# EAGLE design Qwiic GPS - Ublox SAM-M8Q (EAGLE 9.3.0)
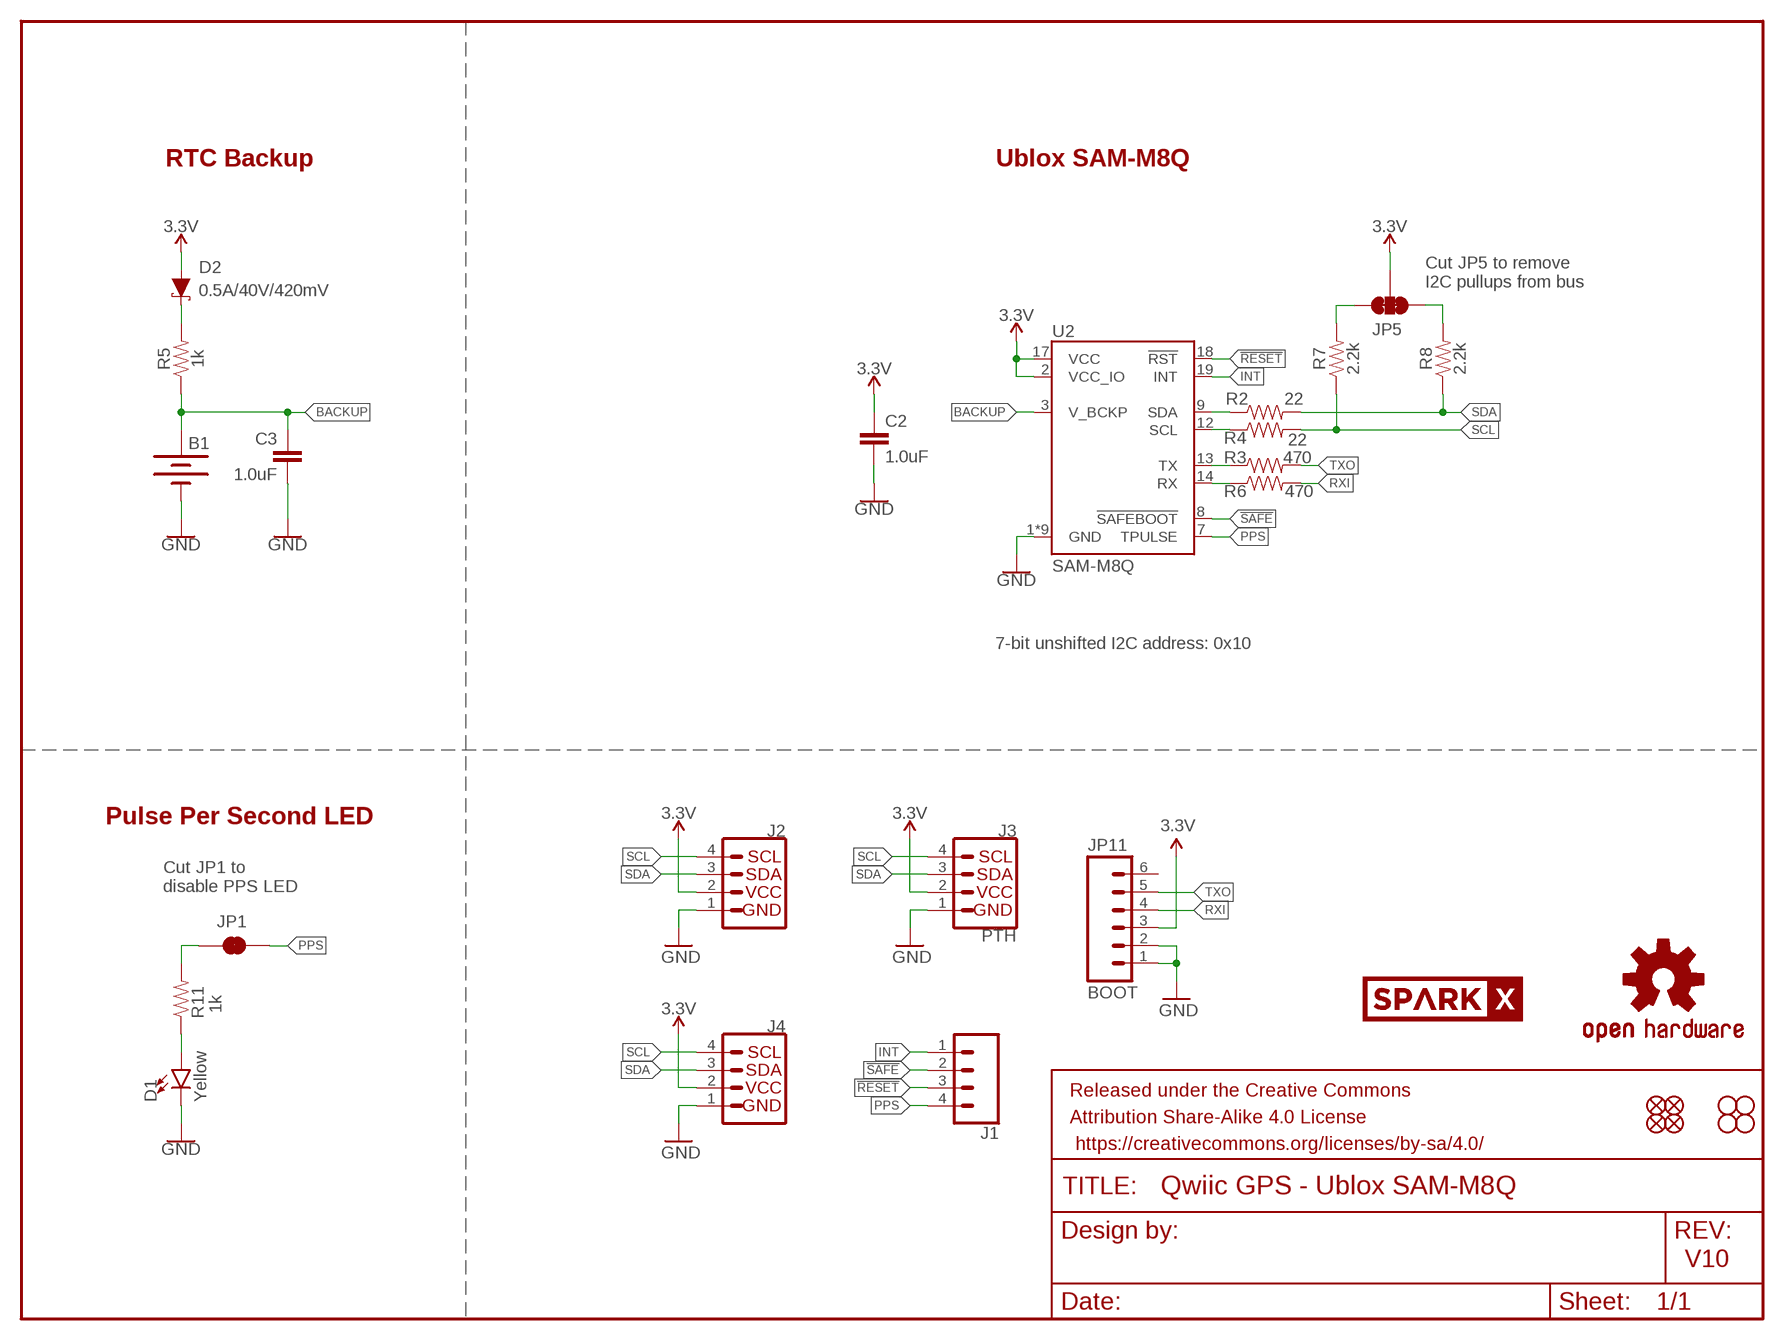
[diagram p0: schematic, sheet 1]

## Parts
B1  6.8MM_COIN_CELL  ML414H_IV01E_BATTERY  [ML414H_IV01E]
C2  1.0uF  1.0UF-0603-16V-10%  [0603]
C3  1.0uF  1.0UF-0603-16V-10%  [0603]
D1  Yellow  LED-YELLOW0603  [LED-0603]
D2  0.5A/40V/420mV  DIODE-SCHOTTKY-PMEG4005EJ  [SOD-323]
FRAME1  FRAME-LETTER  [CREATIVE_COMMONS]
J1  CONN_041X04_NO_SILK  [1X04_NO_SILK]
J2  I2C_STANDARDQWIIC  [1X04_1MM_RA]
J3  PTH  I2C_STANDARD_NO_SILK  [1X04_NO_SILK]
J4  I2C_STANDARDQWIIC  [1X04_1MM_RA]
JP1  JUMPER-SMT_2_NC_TRACE_SILK  [SMT-JUMPER_2_NC_TRACE_SILK]
JP2  FIDUCIALUFIDUCIAL  [MICRO-FIDUCIAL]
JP3  STAND-OFF  [STAND-OFF]
JP4  STAND-OFF  [STAND-OFF]
JP5  JUMPER-SMT_3_2-NC_TRACE_SILK  [SMT-JUMPER_3_2-NC_TRACE_SILK]
JP6  FIDUCIALUFIDUCIAL  [MICRO-FIDUCIAL]
JP7  FIDUCIALUFIDUCIAL  [MICRO-FIDUCIAL]
JP8  FIDUCIALUFIDUCIAL  [MICRO-FIDUCIAL]
JP9  STAND-OFF  [STAND-OFF]
JP10  STAND-OFF  [STAND-OFF]
JP11  BOOT  M06NO_SILK_FEMALE_PTH  [1X06_NO_SILK]
LOGO1  OSHW-LOGOMINI  [OSHW-LOGO-MINI]
R2  22  22OHM-0603-1/10W-1%  [0603]
R3  470  470OHM-0603-1/10W-1%  [0603]
R4  22  22OHM-0603-1/10W-1%  [0603]
R5  1k  1KOHM-0603-1/10W-1%  [0603]
R6  470  470OHM-0603-1/10W-1%  [0603]
R7  2.2k  2.2KOHM-0603-1/10W-1%  [0603]
R8  2.2k  2.2KOHM-0603-1/10W-1%  [0603]
R11  1k  1KOHM-0603-1/10W-1%  [0603]
U2  SAM-M8Q  [SAM-M8Q]
U$31  SPARKX-LOGO4  [SPARKX-MEDIUM]

## Nets
3.3V: C2.1 D2.A J2.2 J3.2(VCC) J4.2 JP5.2 JP11.3 U2.2(VCC_IO) U2.17(VCC)
!RESET: J1.3 U2.18(!RST)
!SAFE: J1.2 U2.8(!SAFEBOOT)
BACKUP: B1.+ C3.1 R5.1 U2.3(V_BCKP)
GND: B1.- C2.2 C3.2 D1.C J2.1 J3.1(GND) J4.1 JP11.1 JP11.2 U2.1(GND) U2.4(GND) U2.5(GND) U2.6(GND) U2.10(GND) U2.11(GND) U2.15(GND) U2.16(GND) U2.20(GND)
INT: J1.1 U2.19(INT)
N$2: D1.A R11.1
N$4: JP1.1 R11.2
N$5: JP5.1 R8.2
N$6: D2.C R5.2
N$8: JP5.3 R7.2
PPS: J1.4 JP1.2 U2.7(TPULSE)
RXI: JP11.4 R6.2
RXLV: R6.1 U2.14(RX)
SCL: J2.4 J3.4(SCL) J4.4 R4.2 R7.1
SCL_LV: R4.1 U2.12(SCL)
SDA: J2.3 J3.3(SDA) J4.3 R2.2 R8.1
SDA_LV: R2.1 U2.9(SDA)
TXLV: R3.1 U2.13(TX)
TXO: JP11.5 R3.2
Unconnected: JP11.6

## Notes on the sheet
- RTC Backup | Ublox SAM-M8Q
- Cut JP5 to remove 
  I2C pullups from bus
- 7-bit unshifted I2C address: 0x10
- Pulse Per Second LED
- Cut JP1 to 
  disable PPS LED
- V10

## Library data of the parts
B1 = SparkFun-Batteries:ML414H_IV01E_BATTERY: SEIKO ML414H-IV01E Reflowable Lithium Battery ML414H is a rechargeable, coin type battery with features such as Pb-free reflowable (Peak temperature: 260 C) and high temperature heat resistance. Battery Characteristics: 3.1V max voltage Voff is 2V 1mAH 3k series resistor with battery 72 hour charge time from 2.0-3.1V 2.3-2.8V initial charge; PROD_ID: BATT-14267
C2 C3 = SparkFun-Capacitors:1.0UF: 1µF ceramic capacitors A capacitor is a passive two-terminal electrical component used to store electrical energy temporarily in an electric field.; PROD_ID: CAP-00868
D1 = SparkFun-LED:LED-YELLOW: Yellow SMD LED Used in manufacturing several products at SparkFun. Packages: 0603 - SMD 0603 package[Product Link] <http://www.kingbrightusa.com/product.asp?catalog_name=LED&product_id=APT1608SYCK> 0603 -SMART - SMART SMD 0603 package (more efficient/more expensive) [Product Link] <http://www.osram-os.com/osram_os/en/products/product-catalog/led-light-emitting-diodes/smartled-0603/ly-l29k/index.jsp> LilyPad - SMD1206 package[Product Datasheet] <https://www.sparkfun.com/datasheets/DevTools/LilyPad/Q150YUS4.pdf> SparkFun Products: Blynk Board <https://www.sparkfun.com/products/13794> IOIO-OTG <https://www.sparkfun.com/products/13613> XBee Explorer Serial <https://www.sparkfun.com/products/13225>; PROD_ID: DIO-09003
D2 = SparkFun-DiscreteSemi:DIODE-SCHOTTKY: Schottky diode A Schottky diode is a semiconductor diode which has a low forward voltage drop and a very fast switching action.; PROD_ID: DIO-10955
FRAME1 = SparkFun-Aesthetics:FRAME-LETTER: Schematic Frame - Letter Standard 8.5x11 US Letter frame
J1 = SparkFun-Connectors:CONN_04: Multi connection point. Often used as Generic Header-pin footprint for 0.1 inch spaced/style header connections On any of the 0.1 inch spaced packages, you can populate with these: Break Away Headers - Straight <https://www.sparkfun.com/products/116> (PRT-00116) Break Away Male Headers - Right Angle <https://www.sparkfun.com/products/553> (PRT-00553) Female Headers <https://www.sparkfun.com/products/115> (PRT-00115) Break Away Headers - Machine Pin <https://www.sparkfun.com/products/117> (PRT-00117) Break Away Female Headers - Swiss Machine Pin <https://www.sparkfun.com/products/743> (PRT-00743) For SCREWTERMINALS and SPRING TERMINALS visit here: Screw Terimnals on SparkFun.com <https://www.sparkfun.com/search/results?term=Screw+Terminals> (5mm/3.5mm/2.54mm spacing) This device is also useful as a general connection point to wire up your design to another part of your project. Our various solder wires solder well into these plated through hole pads. Hook-Up Wire - Assortment (Stranded, 22 AWG) <https://www.sparkfun.com/products/11375> (PRT-11375) Hook-Up Wire - Assortment (Solid Core, 22 AWG) <https://www.sparkfun.com/products/11367> (PRT-11367) View the entire wire category on our website here <https://www.sparkfun.com/categories/141> Special notes: Molex polarized connector foot print use with SKU : PRT-08231 with associated crimp pins and housings. 1MM SMD Version SKU: PRT-10208; PROD_ID: CONN-09696
J2 J4 = SparkFun-Connectors:I2C_STANDARD: SparkFun I2C Standard Pinout Header SparkFun has standardized on a pinout for all I2C based sensor breakouts. This pinout allows I2C boards to be plugged directly into the headers on Arduino Uno compatible boards, and to be daisy chained easily. Example SparkFun Products: SparkFun Atmospheric Sensor Breakout - BME280 <https://www.sparkfun.com/products/13676> SparkFun Altitude/Pressure Sensor Breakout - MPL3115A2 <https://www.sparkfun.com/products/11084> SparkFun TOF Range Finder Sensor - VL6180 <https://www.sparkfun.com/products/12785>; PROD_ID: CONN-13694; VALUE: Qwiic Right Angle
J3 = SparkX:I2C_STANDARD: SparkFun I2C Standard Pinout Header SparkFun has standardized on a pinout for all I2C based sensor breakouts. This pinout allows I2C boards to be plugged directly into the headers on Arduino Uno compatible boards, and to be daisy chained easily. Example SparkFun Products: SparkFun Atmospheric Sensor Breakout - BME280 <https://www.sparkfun.com/products/13676> SparkFun Altitude/Pressure Sensor Breakout - MPL3115A2 <https://www.sparkfun.com/products/11084> SparkFun TOF Range Finder Sensor - VL6180 <https://www.sparkfun.com/products/12785>
JP1 = SparkFun-Jumpers:JUMPER-SMT_2_NC_TRACE: Normally closed trace jumper This jumper has a trace between two pads so it's normally closed (NC). Use a razor knife to open the connection. For best results follow the IPC guidelines for cutting traces: Cutout at least 0.063 mm (0.005 in). Remove all loose material to clean up the cut area. Seal the cut with an approved epoxy. Reapply solder to reclose the connection.
JP2 JP6-JP8 = SparkFun:FIDUCIAL: Fiducial Alignment Points Various fiducial points for machine vision alignment.
JP3 JP4 JP9 JP10 = SparkFun:STAND-OFF: Stand Off This is the mechanical footprint for a #4 phillips button head screw. Use the keepout ring to avoid running the screw head into surrounding components. SKU : PRT-00447
JP5 = SparkFun-Jumpers:JUMPER-SMT_3_2-NC_TRACE: Normally closed trace jumper (2 of 2 connections) This jumper has a trace between all three pads so they are normally closed (NC). Use a razor knife to open the connection(s). For best results follow the IPC guidelines for cutting traces: Cutout at least 0.063 mm (0.005 in). Remove all loose material to clean up the cut area. Seal the cut with an approved epoxy. Reapply solder to reclose the connection(s).
JP11 = SparkFun-Connectors:M06: Header 6 Standard 6-pin 0.1" header. Use with straight break away headers (SKU : PRT-00116), right angle break away headers (PRT-00553), swiss pins (PRT-00743), machine pins (PRT-00117), and female headers (PRT-00115). Molex polarized connector foot print use with SKU : PRT-08094 with associated crimp pins and housings. NOTES ON THE VARIANTS LOCK and LOCK_LONGPADS... This footprint was designed to help hold the alignment of a through-hole component (i.e. 6-pin header) while soldering it into place. You may notice that each hole has been shifted either up or down by 0.005 of an inch from it's more standard position (which is a perfectly straight line). This slight alteration caused the pins (the squares in the middle) to touch the edges of the holes. Because they are alternating, it causes a "brace" to hold the component in place. 0.005 has proven to be the perfect amount of "off-center" position when using our standard breakaway headers. Although looks a little odd when you look at the bare footprint, once you have a header in there, the alteration is very hard to notice. Also,if you push a header all the way into place, it is covered up entirely on the bottom side. This idea of altering the position of holes to aid alignment will be further integrated into the Sparkfun Library for other footprints. It can help hold any component with 3 or more connection pins.; PROD_ID: CONN-08437
LOGO1 = SparkFun-Aesthetics:OSHW-LOGO: Open-Source Hardware (OSHW) Logo This logo indicates the piece of hardware it is found on incorporates a OSHW license and/or adheres to the definition of open source hardware found here: http://freedomdefined.org/OSHW
R2 R4 = SparkFun-Resistors:22OHM: 22Ω resistor A resistor is a passive two-terminal electrical component that implements electrical resistance as a circuit element. Resistors act to reduce current flow, and, at the same time, act to lower voltage levels within circuits. - Wikipedia; PROD_ID: RES-08698
R3 R6 = SparkFun-Resistors:470OHM: 470Ω resistor A resistor is a passive two-terminal electrical component that implements electrical resistance as a circuit element. Resistors act to reduce current flow, and, at the same time, act to lower voltage levels within circuits. - Wikipedia; PROD_ID: RES-07869
R5 R11 = SparkFun-Resistors:1KOHM: 1kΩ resistor A resistor is a passive two-terminal electrical component that implements electrical resistance as a circuit element. Resistors act to reduce current flow, and, at the same time, act to lower voltage levels within circuits. - Wikipedia; PROD_ID: RES-07856
R7 R8 = SparkFun-Resistors:2.2KOHM: 2.2kΩ resistor A resistor is a passive two-terminal electrical component that implements electrical resistance as a circuit element. Resistors act to reduce current flow, and, at the same time, act to lower voltage levels within circuits. - Wikipedia; PROD_ID: RES-08272
U2 = SAM-M8Q:SAM-M8Q
U$31 = SparkX:SPARKX-LOGO

## Net classes
1 vcc: width 0.152 mm

## Board
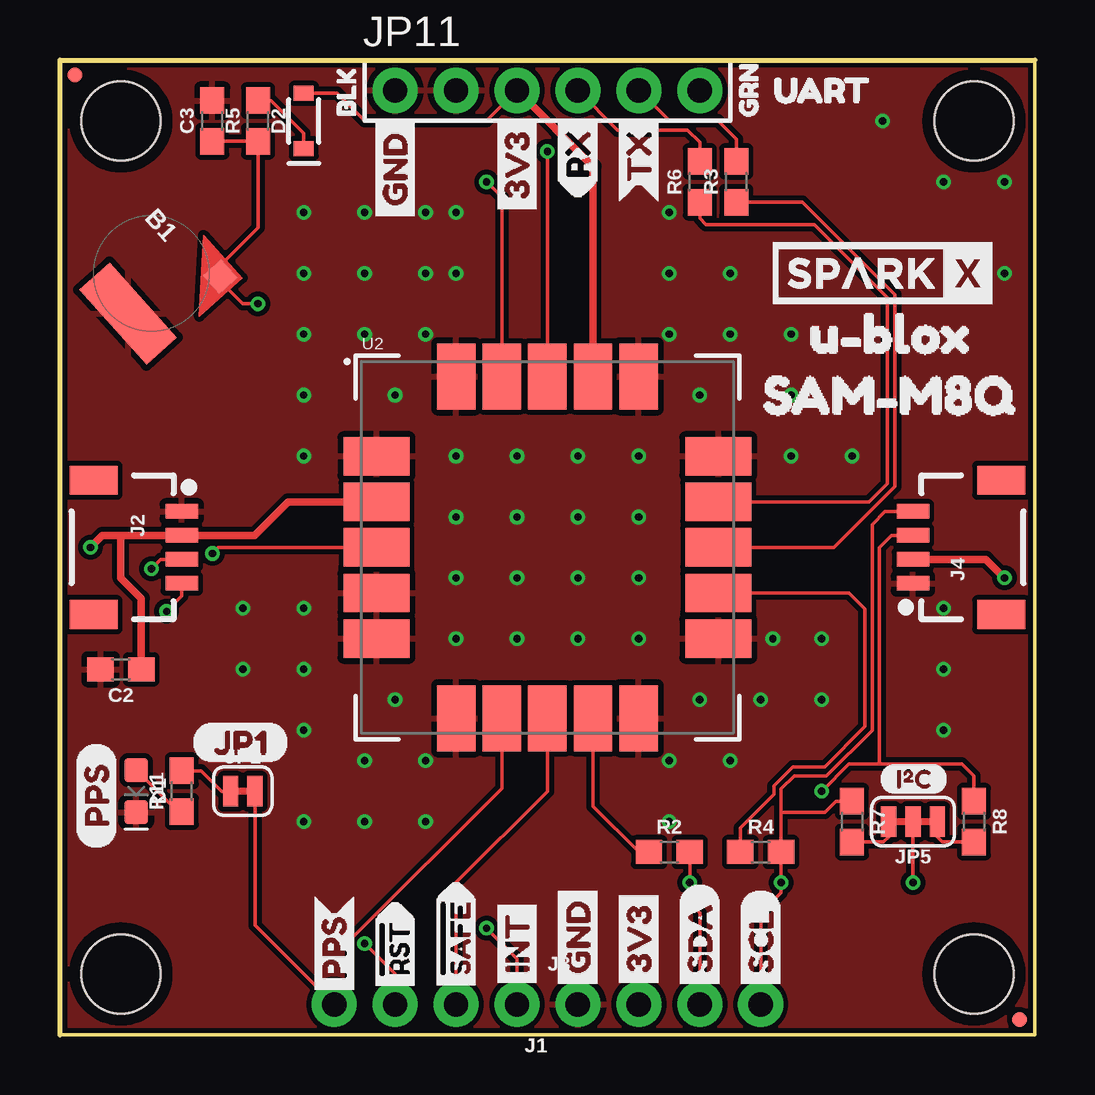
[diagram p1: board, top side]
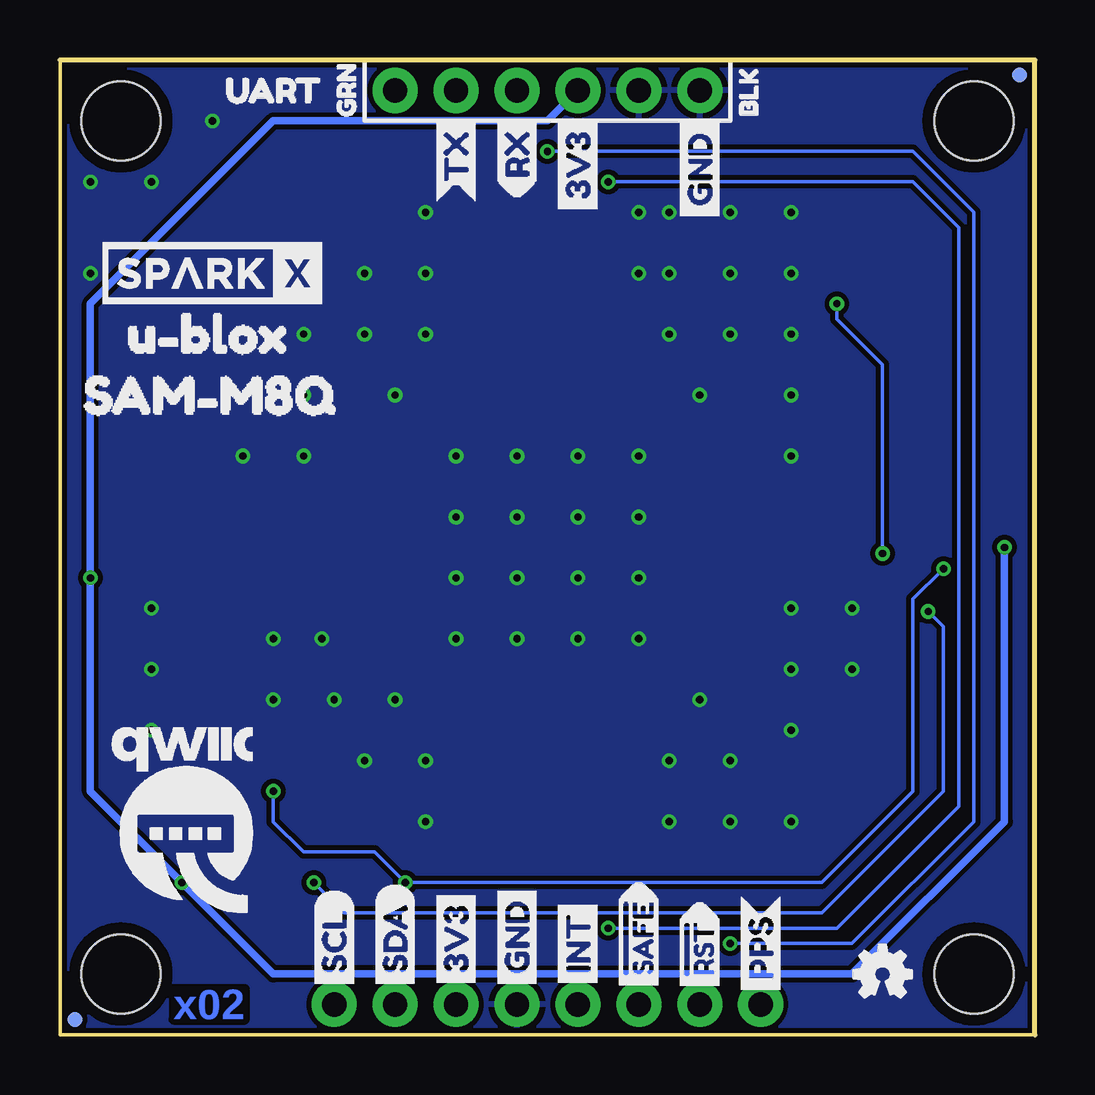
[diagram p2: board, bottom side, seen from below]

Size 40.64 x 40.64 mm. Coordinates in mm from the lower left corner, seen from the top.
Outline: 0,0 0,40.64 40.64,40.64 40.64,0 0,0
Copper layers (1*16): Top 0.035mm / dielectric 1.5mm / Bottom 0.035mm
Design rules "SparkFun-2-layer-PCBWay-LIMIT": minimum track width 6mil, minimum drill 0.3mm, track to track 6mil, track to pad 6mil, pad to pad 6mil, via to via 6mil, smd to smd 6mil, copper to edge 6mil, drill to drill 6mil, minimum pad ring 6mil, minimum via ring 6mil, stop-mask expansion 4mil, vias tented up to drill 25mil, thermal gap 10mil

### Footprints (pad centres in the part's own frame; a part is rotated, then mirrored left to right if it is on the bottom)
ML414H_IV01E = smd 1 x 1: + 2.022,2.032 | smd 4.2 x 1.7: - 0.6,-1.85
0603 = smd 1.1 x 1: 1 -0.85,0; 2 0.85,0
LED-0603 = smd 1 x 1: A -0.877,0; C 0.877,0
SOD-323 = smd 0.63 x 0.83: A 1.15,0; C -1.15,0
1X04_NO_SILK = drill 1.016 pad 1.88: 1 0,0; 2 2.54,0; 3 5.08,0; 4 7.62,0
1X04_1MM_RA = smd 0.6 x 1.35: 1 -1.5,0; 2 -0.5,0; 3 0.5,0; 4 1.5,0 | smd 1.2 x 2: NC1 2.8,-3.675; NC2 -2.8,-3.675
SMT-JUMPER_2_NC_TRACE_SILK = smd 0.635 x 1.27: 1 -0.508,0; 2 0.508,0
MICRO-FIDUCIAL = smd 0.635 x 0.635: 1 0,0
STAND-OFF = hole 3.302: 0,0
SMT-JUMPER_3_2-NC_TRACE_SILK = smd 0.635 x 1.27: 1 -1.016,0; 2 0,0; 3 1.016,0
1X06_NO_SILK = drill 1.016 pad 1.88: 1 0,0; 2 2.54,0; 3 5.08,0; 4 7.62,0; 5 10.16,0; 6 12.7,0
SAM-M8Q = smd 2.75 x 1.6: 1 -7.125,3.8; 2 -7.125,1.9; 3 -7.125,0; 4 -7.125,-1.9; 5 -7.125,-3.8; 11 7.125,-3.8; 12 7.125,-1.9; 13 7.125,0; 14 7.125,1.9; 15 7.125,3.8 | smd 1.6 x 2.75: 6 -3.8,-7.125; 7 -1.9,-7.125; 8 0,-7.125; 9 1.9,-7.125; 10 3.8,-7.125; 16 3.8,7.125; 17 1.9,7.125; 18 0,7.125; 19 -1.9,7.125; 20 -3.8,7.125

### Placement (x,y rotation side)
B1  3.81,31.75 312 top
C2  2.54,15.24 180 top
C3  6.35,38.1 90 top
D1  3.17,10.16 270 top
D2  10.16,38.1 90 top
FRAME1  -17.78,-17.78 0 top  (outside the outline)
J1  19.05,1.27 180 top
J2  5.08,20.32 270 top
J3  21.59,1.27 0 top
J4  35.56,20.32 90 top
JP1  7.62,10.16 0 top
JP2  40.01,0.64 0 top
JP3  2.54,38.1 0 top
JP4  38.1,38.1 0 top
JP5  35.56,8.89 180 top
JP6  0.64,40.01 0 top
JP7  40.01,0.64 0 bottom
JP8  0.64,40.01 0 bottom
JP9  2.54,2.54 0 top
JP10  38.1,2.54 0 top
JP11  13.97,39.37 0 top
LOGO1  6.35,2.54 0 bottom
R2  25.4,7.62 0 top
R3  28.19,35.56 90 top
R4  29.21,7.62 0 top
R5  8.26,38.1 90 top
R6  26.67,35.56 90 top
R7  33.02,8.89 270 top
R8  38.1,8.89 270 top
R11  5.08,10.16 90 top
U2  20.32,20.32 0 top
U$1  [SDA-[)]  26.67,1.65 90 top
U$2  SPARKX-LOGO4  [SPARKX-MEDIUM]  34.29,31.75 0 bottom
U$3  [SCL-[)]  29.21,1.65 90 top
U$4  [SDA-[)]  26.67,1.65 90 bottom
U$5  [SCL-[)]  29.21,1.65 90 bottom
U$6  [3V3-04]  24.13,1.65 90 top
U$7  [3V3-04]  24.13,1.65 90 bottom
U$8  [GND-04]  21.59,1.65 90 top
U$9  [GND-04]  21.59,1.65 90 bottom
U$10  [I_SUPER2_C-()-03]  34.16,10.67 0 top
U$11  [UART0]  34.67,39.37 0 bottom
U$12  [BLK1]  11.94,37.59 90 top
U$13  [BLK1]  11.94,37.59 90 bottom
U$14  [GRN2]  28.7,37.59 90 top
U$15  [INT8]  19.05,1.65 90 top
U$16  [INT8]  19.05,1.65 90 bottom
U$17  [GRN2]  28.7,37.59 90 bottom
U$18  [JP10]  5.46,12.19 0 top
U$19  [RX6]  21.59,34.8 90 top
U$20  [RX6]  21.59,34.8 90 bottom
U$21  [SAM#M8Q4]  27.94,26.67 0 top
U$22  [U#BLOX3]  39.24,29.21 0 bottom
U$23  [TX7]  24.13,34.67 90 top
U$24  [TX7]  24.13,34.67 90 bottom
U$25  [SAM#M8Q4]  41.02,26.67 0 bottom
U$26  [U#BLOX3]  29.84,29.21 0 top
U$27  [3V3-04]  19.05,33.91 90 top
U$28  [QWIIC-LOGO-LARGE]  35.56,8.89 0 bottom
U$29  [PPS0]  1.52,7.75 90 top
U$31  34.29,31.75 0 top
U$32  [3V3-04]  19.05,33.91 90 bottom
U$33  [GND-04]  13.97,33.66 90 top
U$34  [GND-04]  13.97,33.66 90 bottom
U$35  [#RST3]  13.97,1.4 90 top
U$36  [#RST3]  13.97,1.4 90 bottom
U$39  [#SAFE1]  16.51,1.4 90 top
U$40  [#SAFE1]  16.51,1.4 90 bottom
U$43  [PPS5]  11.43,1.4 90 top
U$44  [PPS5]  11.43,1.4 90 bottom
U$45  [UART0]  28.83,39.37 0 top

### Tracks (layer width: path | path; a pad name or v marks a point on that pad's centre or on a via)
3.3V  (via drill 0.3)
  Top 0.152: D2.A 11.55,39.25 12.7,38.1 17.78,38.1 JP11.3 | JP5.2 v35.56,6.35
  Top 0.305: U2.2 9.52,22.22 8.12,20.82 J2.2 2.54,20.82 | v39.37,19.05 38.6,19.82 J4.2 | U2.17 22.22,36.2 JP11.3 | v1.27,20.32 1.77,20.82 2.54,20.82 | C2.1 3.39,18.2 2.54,19.05 2.54,20.82
  Bottom 0.305: JP11.3 20.32,38.1 31.75,38.1 39.37,30.48 v39.37,19.05 39.37,10.16 v35.56,6.35 31.75,2.54 24.13,2.54 | 24.13,2.54 7.62,2.54 1.27,8.89 v1.27,20.32 | J3.2 24.13,2.54
!RESET  (via drill 0.3)
  Top 0.152: v20.32,36.83 U2.18 | J1.3 13.97,2.54 v12.7,3.81
  Bottom 0.152: v12.7,3.81 7.62,3.81 2.54,8.89 2.54,34.29 5.08,36.83 v20.32,36.83
!SAFE
  Top 0.152: J1.2 16.51,6.35 20.32,10.16 U2.8
BACKUP  (via drill 0.3)
  Top 0.152: C3.1 R5.1 8.26,33.66 6.67,32.07 | U2.3 6.6,20.32 v6.35,20.07 | v8.26,30.48 7.62,30.48 6.67,31.43
  Top 0.254: 6.67,31.43 B1.+ 6.67,32.07
  Bottom 0.152: v6.35,20.07 6.35,27.94 8.26,29.84 v8.26,30.48
GND  (via drill 0.3)
  other vias: 16.51,24.13 19.05,24.13 21.59,24.13 24.13,24.13 16.51,19.05 19.05,19.05 21.59,19.05 24.13,19.05 16.51,21.59 19.05,21.59 21.59,21.59 24.13,21.59 10.16,17.78 10.16,15.24 10.16,12.7 12.7,11.43 13.97,13.97 26.67,13.97 26.67,26.67 13.97,26.67 10.16,24.13 10.16,26.67 10.16,29.21 12.7,29.21 27.94,29.21 30.48,29.21 30.48,26.67 30.48,24.13 27.94,11.43 25.4,11.43 15.24,11.43 15.24,29.21 25.4,29.21 34.29,38.1 36.83,35.56 39.37,35.56 39.37,31.75 36.83,12.7 36.83,15.24 16.51,16.51 19.05,16.51 21.59,16.51 24.13,16.51 16.51,31.75 12.7,31.75 10.16,31.75 25.4,31.75 27.94,31.75 25.4,34.29 29.21,13.97 31.75,13.97 31.75,16.51 29.72,16.51 36.83,17.78 33.02,24.13 16.51,34.29 12.7,34.29 10.16,34.29 15.24,31.75 15.24,34.29 15.24,8.89 12.7,8.89 10.16,8.89 7.62,17.78 7.62,15.24 25.4,8.89
  pour Top (isolate 0.203): 0,40.64 40.64,40.64 40.64,0 0,0
  pour Bottom (isolate 0.203): 0,40.64 40.64,40.64 40.64,0 0,0
INT  (via drill 0.3)
  Top 0.152: v17.78,35.56 18.42,34.92 U2.19 | J1.1 19.05,3.17 v17.78,4.45
  Bottom 0.152: v17.78,4.45 8.26,4.45 3.17,9.53 3.17,33.66 5.08,35.56 v17.78,35.56
N$2
  Top 0.152: R11.1 4.9,9.31 D1.A
N$4
  Top 0.152: JP1.1 6.73,10.16 5.88,11.01 R11.2
N$5
  Top 0.152: R8.2 36.79,8.04 36.58,8.26 JP5.1
N$6
  Top 0.152: R5.2 8.8,38.95 10.16,37.59 D2.C
N$8
  Top 0.152: R7.2 34.33,8.04 34.54,8.26 JP5.3
PPS
  Top 0.152: JP1.2 8.13,4.57 J1.4 12.17,2.01 12.17,4.03 18.42,10.28 U2.7
RXI
  Top 0.152: JP11.4 23.24,37.72 26.16,37.72 26.67,37.21 R6.2
RXLV
  Top 0.152: U2.14 33.73,22.22 34.49,22.99 34.49,30.73 31.45,33.78 26.92,33.78 26.67,34.04 R6.1
SCL  (via drill 0.3)
  Top 0.152: J3.4 29.21,5.08 30.06,5.93 R4.2 | v30.06,6.35 R4.2 | J2.4 5.08,18.29 v4.45,17.65 | J4.4 34.39,21.82 33.86,21.29 33.86,12.7 31.95,10.79 30.61,10.79 30.06,10.25 30.06,9.27 | R4.2 30.06,9.27 | R7.1 32.35,9.74 31.88,9.27 30.06,9.27
  Bottom 0.152: v4.45,17.65 3.81,17.02 3.81,10.16 8.89,5.08 28.79,5.08 v30.06,6.35
SCL_LV
  Top 0.152: R4.1 28.36,8.64 29.75,10.03 29.75,10.37 30.56,11.18 31.88,11.18 33.55,12.85 33.55,17.75 32.89,18.42 U2.12
SDA  (via drill 0.3)
  Top 0.152: J3.3 26.67,5.08 26.25,5.5 v26.25,6.35 R2.2 26.67,7.62 | R8.1 38.1,10.79 37.59,11.3 34.16,11.3 | v3.81,19.43 4.2,19.82 J2.3 | J4.3 34.66,20.82 34.16,20.32 34.16,11.3 | v31.75,10.16 32.89,11.3 34.16,11.3
  Bottom 0.152: v3.81,19.43 5.08,18.16 5.08,10.16 8.89,6.35 v26.25,6.35 27.52,7.62 30.48,7.62 31.75,8.89 v31.75,10.16
SDA_LV
  Top 0.152: U2.9 22.22,9.53 24.13,7.62 R2.1
TXLV
  Top 0.152: U2.13 32.26,20.32 34.8,22.86 34.8,30.86 32,33.66 30.95,34.71 R3.1
TXO
  Top 0.152: JP11.5 25.4,38.1 27.43,38.1 28.19,37.34 R3.2

### Text on the board
Bottom: x02
Measures: Measurements in inches